# Altium project gtrack_tag_v2.PrjPcb (part 2 of 2)

## Sheet buck_converter.SchDoc
size 297 x 209 mm; DrawnBy: Supun; Engineer: Supun; Organization: C3
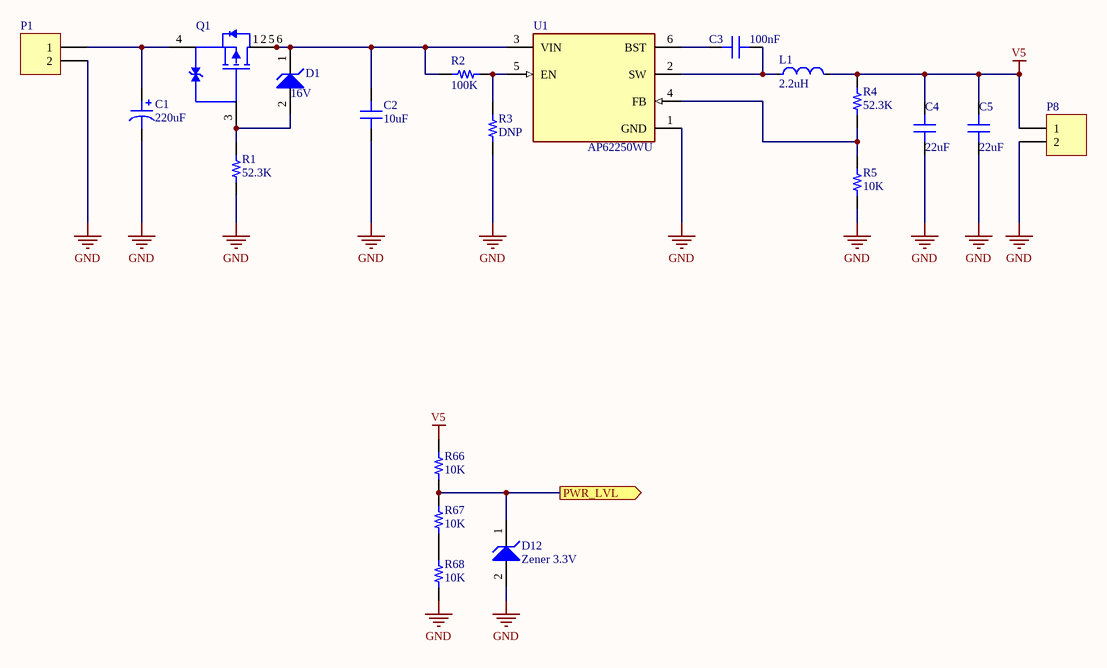
[diagram p10: buck_converter.SchDoc]

### Parts
C1  220uF  [CAP TH ALUM ELEC D10.00mm S5.00mm H12.50mm]
C2  10uF  [CAP 0603_1608]
C3  100nF  [CAP 0603_1608]
C4  22uF  [CAP 0603_1608]
C5  22uF  [CAP 0603_1608]
D1  16V  [Diodes_SOD-123_0]
D12  Zener 3.3V  [Diodes_SOD-123_0]
L1  2.2uH  [Vishay_IHLP-2020CZ-FP_1_905x2_79-3D_3_0_MFG]
P1  *  [TEConn_EP2.5_1x2]  (value not drawn)
P8  DNP  [HDR1X2]  (value not drawn)
Q1  P Mosfet  [Diodes_Inc._TSOT26_MFG]  (value not drawn)
R1  52.3K  [RES 0603_1608]
R2  100K  [RES 0603_1608]
R3  DNP  [RES 0603_1608]
R4  52.3K  [RES 0603_1608]
R5  10K  [RES 0603_1608]
R66  10K  [RES 0603_1608]
R67  10K  [RES 0603_1608]
R68  10K  [RES 0603_1608]
U1  AP62250WU  [Diodes_Inc._TSOT26_MFG]

### Ports
PWR_LVL (out)

### Nets
GND: C1.2 C2.2 C4.2 C5.2 D12.2(A) P1.2 P8.2 R1.2 R3.2 R5.2 R68.2 U1.1(GND)
V5: C4.1 C5.1 L1.2 P8.1 R4.1 R66.1
PWR_LVL: D12.1(K) R66.2 R67.1 ; port PWR_LVL
NetC1_1: C1.1 P1.1 Q1.4(S)
NetC2_1: C2.1 D1.1(K) Q1.1(D) Q1.2(D) Q1.5(D) Q1.6(D) R2.2 U1.3(VIN)
NetC3_1: C3.1 U1.6(BST)
NetC3_2: C3.2 L1.1 U1.2(SW)
NetD1_2: D1.2(A) Q1.3(G) R1.1
NetR2_1: R2.1 R3.1 U1.5(EN)
NetR4_2: R4.2 R5.1 U1.4(FB)
NetR67_2: R67.2 R68.1

### Notes on the sheet
- Title
- Size:
- Date:
- A4
- Number:
- Time:
- Revision:
- Sheet
- of
- File:

### Library data of the parts
C1 = Polarised Capacitor: SMT Polarised Capacitor; MF: KEMET; MP: ESK227M035AH1AA; Value: 220uF; Link: https://www.mouser.com/ProductDetail/KEMET/ESH227M050AH1AA?qs=w9hhVRgtvfmnb2YOvt619g%3D%3D
C2 = Capacitor: SMT Capacitor; MF: Murata; MP: GRM188R61C106MAALD; Value: 10uF; Link: https://www.mouser.com/ProductDetail/Murata-Electronics/GRM188R61C106MAALD?qs=hNud%2FORuBR3LEOKZ4RJp9w%3D%3D
C3 = Capacitor: SMT Capacitor; MF: TDK; MP: CGA3E2X7R1E104K080AA; Value: 100nF; Link: https://www.mouser.com/ProductDetail/TDK/CGA3E2X7R1E104K080AA?qs=NRhsANhppD%2Fm7%2FOmmsm0vg%3D%3D
C4 C5 = Capacitor: SMT Capacitor; MF: Murata; MP: GRM188R61A226ME15D; Value: 22uF; Link: https://www.mouser.com/ProductDetail/Murata-Electronics/GRM188R61A226ME15D?qs=eeBpzGFlv%252B8DV%2FrilzyhAw%3D%3D
D1 = Zener Diode: Zener Voltage Regulator; Manufacturer: On Semiconductor; Packing: Tape and Reel; P Max (W): 0.5; VZ Typ (V): 4.7; MF: Onsemi; MP: MMSZ5246BT1G; ComponentLink1Description: Manufacturer URL; ComponentLink2Description: Datasheet; DatasheetVersion: Rev. 12; ComponentLink3URL: http://www.onsemi.com/pub_link/Collateral/425-04.PDF; ComponentLink3Description: Package Specification; ComponentLink1URL: http://www.onsemi.com/; ComponentLink2URL: http://www.onsemi.com/pub_link/Collateral/MMSZ5221BT1-D.PDF; PackageVersion: Rev. G, 10/2009; PackageReference: SOD-123-2-425-04; PackageDescription: 2-Pin SOD, Body 1.6 x 2.69 mm; Mounting Technology: Surface Mount; RoHS: Pb-Free; Value: 16V; Link: https://www.mouser.com/ProductDetail/onsemi/MMSZ5246BT1G?qs=P4IOph%252Bbot93aqBP107C%2FQ%3D%3D
D12 = Zener Diode: Zener Voltage Regulator; Manufacturer: On Semiconductor; Packing: Tape and Reel; P Max (W): 0.5; VZ Typ (V): 4.7; MF: Onsemi; MP: MMSZ5226BT1G; ComponentLink1Description: Manufacturer URL; ComponentLink2Description: Datasheet; DatasheetVersion: Rev. 12; ComponentLink3URL: http://www.onsemi.com/pub_link/Collateral/425-04.PDF; ComponentLink3Description: Package Specification; ComponentLink1URL: http://www.onsemi.com/; ComponentLink2URL: http://www.onsemi.com/pub_link/Collateral/MMSZ5221BT1-D.PDF; PackageVersion: Rev. G, 10/2009; PackageReference: SOD-123-2-425-04; PackageDescription: 2-Pin SOD, Body 1.6 x 2.69 mm; Mounting Technology: Surface Mount; RoHS: Pb-Free; Value: Zener 3.3V; Link: https://www.mouser.com/ProductDetail/onsemi/MMSZ5226BT1G?qs=P4IOph%252Bbot%2Ft8yNxdh48XQ%3D%3D
L1 = Inductor_sm: Fixed Inductors 2.2uH 20% High Temp AEC-Q200; MF: Vishay; MP: IHLP2020CZER2R2M11; Value: 2.2uH; Link: https://www.mouser.com/ProductDetail/Vishay-Dale/IHLP2020CZER2R2M11?qs=6luCnr706CzLTrsnHEyf2A%3D%3D
P1 = Header 2H: Header, 2-Pin, Right Angle; MF: TE Connectivity; MP: 1744426-2; LatestRevisionDate: 17-Jul-2002; LatestRevisionNote: Re-released for DXP Platform.; Publisher: Altium Limited; Value: *; Link: https://www.mouser.com/ProductDetail/TE-Connectivity-AMP/1744426-2?qs=IGPQaF7TU6sqa55bZxfMjA%3D%3D
P8 = Header 2: Header, 2-Pin; LatestRevisionDate: 17-Jul-2002; LatestRevisionNote: Re-released for DXP Platform.; Publisher: Altium Limited; Value: DNP; Link: https://
Q1 = Mosfet-P-6_ESD: P-Channel Enhancement Mode MOS Transistor, 3-Pin SOT23; MF: Vishay; MP: SI3421DV-T1-GE3; Value: P Mosfet; Link: https://www.mouser.com/ProductDetail/Vishay-Semiconductors/SI3421DV-T1-GE3?qs=dpt6vIvaxwjvmZPXyyVpRg%3D%3D
R1 R4 = Resistor: SMT Resistor; MF: YAGEO; MP: AC0603FR-0752K3L; Value: 52.3K; Link: https://www.mouser.com/ProductDetail/YAGEO/AC0603FR-0752K3L?qs=ygRr%2Ftkhtes52vQmIU4puQ%3D%3D
R2 R3 = Resistor: SMT Resistor; MF: YAGEO; MP: AC0603FR-07100KL; Link: https://www.mouser.com/ProductDetail/YAGEO/AC0603FR-07100KL?qs=UoPT7wUmgYKBKZ83mTH%252BSA%3D%3D
  R2: Value: 100K
  R3: Value: DNP
R5 R66-R68 = Resistor: SMT Resistor; MF: YAGEO; MP: AC0603FR-0710KL; Value: 10K; Link: https://www.mouser.com/ProductDetail/YAGEO/AC0603FR-0710KL?qs=UoPT7wUmgYKz3zh0UDMA4Q%3D%3D
U1 = AP62250WU: Switching Voltage Regulators DCDC Conv HV Buck TSOT26; MF: Diodes Incorporated; MP: AP62250WU-7; Link: https://www.mouser.com/ProductDetail/Diodes-Incorporated/AP62250WU-7?qs=7MVldsJ5Uax1PUc8sdeimQ%3D%3D

## Sheet motion_sensor.SchDoc
size 297 x 209 mm; DrawnBy: Supun; Engineer: Supun; Organization: C3
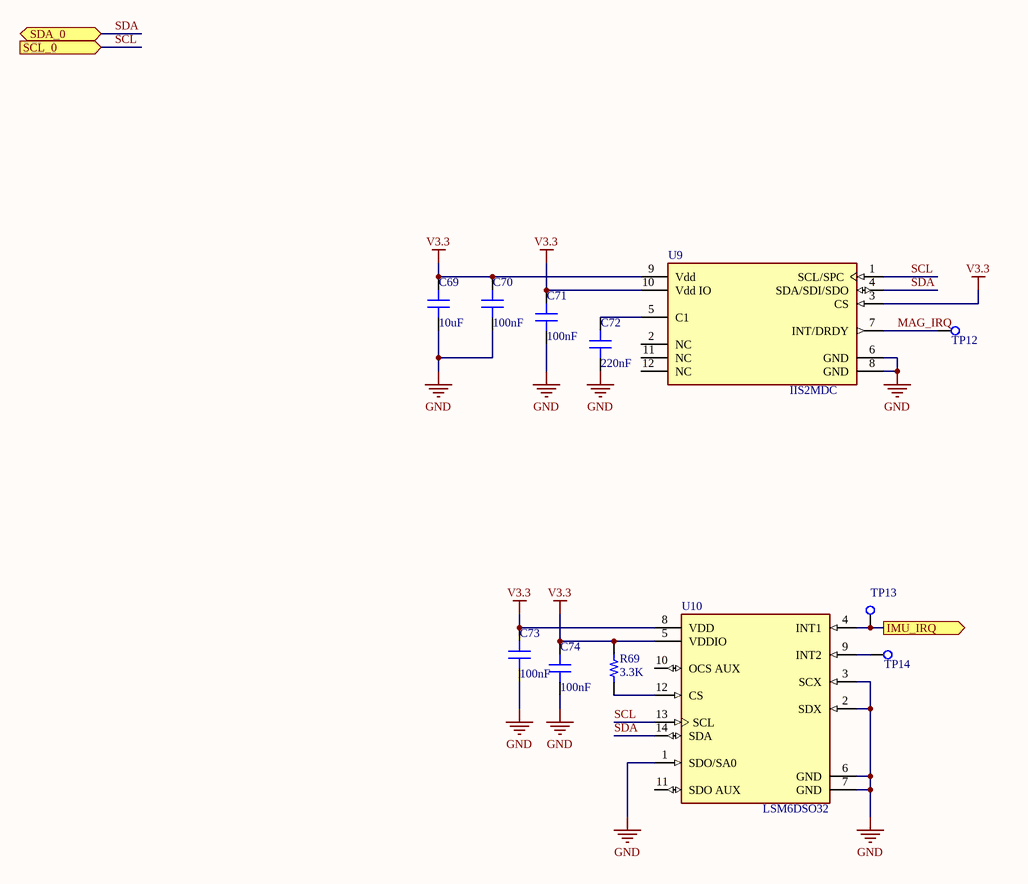
[diagram p11: motion_sensor.SchDoc]

### Parts
C69  10uF  [CAP 0603_1608]
C70  100nF  [CAP 0603_1608]
C71  100nF  [CAP 0603_1608]
C72  220nF  [CAP 0603_1608]
C73  100nF  [CAP 0603_1608]
C74  100nF  [CAP 0603_1608]
R69  3.3K  [RES 0603_1608]
TP12  Test Point  [TPSMD_S1]  (value not drawn)
TP13  Test Point  [TPSMD_S1]  (value not drawn)
TP14  Test Point  [TPSMD_S1]  (value not drawn)
U9  IIS2MDC  [STMicroelectronics_LGA-12-DM00170568_MFG]
U10  LSM6DSO32  [STMicroelectronics_LGA-14L-DM00249496_MFG]

### Ports
IMU_IRQ (out), SCL_0 (in), SDA_0 (bidir)

### Nets
GND: C69.2 C70.2 C71.2 C72.2 C73.2 C74.2 U9.6(GND) U9.8(GND) U10.1(SDO/SA0) U10.2(SDX) U10.3(SCX) U10.6(GND) U10.7(GND)
V3.3: C69.1 C70.1 C71.1 C73.1 C74.1 R69.2 U9.3(CS) U9.9(Vdd) U9.10(Vdd_IO) U10.5(VDDIO) U10.8(VDD)
IMU_IRQ: TP13.1(TP) U10.4(INT1) ; port IMU_IRQ
MAG_IRQ: TP12.1(TP) U9.7(INT/DRDY)
SCL: U9.1(SCL/SPC) U10.13(SCL) ; port SCL_0
SDA: U9.4(SDA/SDI/SDO) U10.14(SDA) ; port SDA_0
NetC72_1: C72.1 U9.5(C1)
NetR69_1: R69.1 U10.12(CS)
NetTP14_1: TP14.1(TP) U10.9(INT2)

Not connected (* = marked no-connect by the designer): U9 2(NC) 11(NC) 12(NC); U10 10(OCS_AUX) 11(SDO_AUX)

### Notes on the sheet
- Title
- Size:
- Date:
- A4
- Number:
- Time:
- Revision:
- Sheet
- of
- File:

### Library data of the parts
C69 = Capacitor: as C2 on sheet buck_converter; Value: 10uF; Link: https://www.mouser.com/ProductDetail/Murata-Electronics/GRM188R61C106MAALD?qs=hNud%2FORuBR3LEOKZ4RJp9w%3D%3D
C70 C71 C73 C74 = Capacitor: as C3 on sheet buck_converter; Value: 100nF; Link: https://www.mouser.com/ProductDetail/TDK/CGA3E2X7R1E104K080AA?qs=NRhsANhppD%2Fm7%2FOmmsm0vg%3D%3D
C72 = Capacitor: SMT Capacitor; MF: Samsung; MP: CL10B224KO8NNNC; Value: 220nF; Link: https://www.mouser.com/ProductDetail/Samsung-Electro-Mechanics/CL10B224KO8NNNC?qs=349EhDEZ59ovd%252B6gRVIaTg%3D%3D
R69 = Resistor: SMT Resistor; MF: YAGEO; MP: AC0603FR-073K3L; Value: 3.3K; Link: https://www.mouser.com/ProductDetail/YAGEO/AC0603FR-073K3L?qs=yhV1fb9g%2FKZasQ4U0IUUCA%3D%3D
U9 = IIS2MDCTR: Board Mount Hall Effect / Magnetic Sensors High accuracy, ultra-low-power ,3-axis digital output magnetometer; MF: STMicroelectronics; MP: IIS2MDCTR; Link: https://www.mouser.com/ProductDetail/STMicroelectronics/IIS2MDCTR?qs=1mbolxNpo8ems1K%2FRdQzXg%3D%3D
U10 = LSM6DSOTR: Inertial Measurement Unit, 6-axis, I2C, SPI, 1.7V-3.6V; MF: STMicroelectronics; MP: LSM6DSO32TR; Link: https://www.mouser.com/ProductDetail/STMicroelectronics/LSM6DSO32TR?qs=rI7uf1IzohQPdukPhHG9Gw%3D%3D
TP12-TP14 = Test Point: Link: https://

## Nets that join several sheets
GND: battery_charger (12 pins), buck_boost_converter (9 pins), microcontroller (25 pins), rfid_reader (29 pins), ultra_wideband (44 pins), button_panel (5 pins), barcode_scanner (C14.1 C15.2 P3.3 P7.2), buzzer (Q5.2), epd_driver (20 pins), buck_converter (12 pins), motion_sensor (13 pins)
V3.3: buck_boost_converter (6 pins), microcontroller (24 pins), ultra_wideband (12 pins), button_panel (8 pins), epd_driver (Q8.4 R62.1), motion_sensor (11 pins)
V3.3P: buck_boost_converter (6 pins), rfid_reader (6 pins), button_panel (C20.2 P4.1), barcode_scanner (C14.2 C15.1 P3.2), buzzer (D8.1 LS1.1 R59.2)
V5: battery_charger (8 pins), buck_converter (6 pins)
VSUP: battery_charger (D3.1 Q7.4 R9.1), buck_boost_converter (5 pins)
BAT_LVL: battery_charger (D4.1 R11.2 R12.1), microcontroller (U4.38)
BTN_1: microcontroller (U4.8), button_panel (C16.1 R14.1 S1.4)
BTN_2: microcontroller (U4.9), button_panel (C17.1 R15.1 S2.3)
BTN_3: microcontroller (U4.11), button_panel (C18.1 R16.1 S3.4)
BTN_4: microcontroller (U4.12), button_panel (C19.1 R17.1 S4.3)
BTN_EXT: microcontroller (U4.40), button_panel (C20.1 P4.3 R18.1)
BUZZER: microcontroller (U4.29), buzzer (R60.1)
DISP_CS: microcontroller (U4.34), epd_driver (P6.12)
DISP_DC: microcontroller (U4.35), epd_driver (P6.11)
DISP_IRQ: microcontroller (U4.36), epd_driver (P6.9)
IMU_IRQ: microcontroller (U4.16), motion_sensor (TP13.1 U10.4)
MISO_0: microcontroller (U4.2), ultra_wideband (U7.40)
MISO_1: microcontroller (U4.15), rfid_reader (U6.16)
MOSI_0: microcontroller (U4.5), ultra_wideband (U7.39)
MOSI_1: microcontroller (U4.14), rfid_reader (U6.17), epd_driver (P6.14)
PWR_CON: buck_boost_converter (R40.1), microcontroller (U4.30)
PWR_LVL: microcontroller (U4.39), buck_converter (D12.1 R66.2 R67.1)
RFID_CS: microcontroller (U4.27), rfid_reader (U6.15)
RFID_IRQ: microcontroller (U4.28), rfid_reader (R43.1 U6.14)
RST: microcontroller (U4.37), epd_driver (P6.10 R64.1)
RX_1: microcontroller (U4.32), barcode_scanner (P3.5)
SCK_0: microcontroller (U4.4), ultra_wideband (U7.41)
SCK_1: microcontroller (U4.13), rfid_reader (U6.18), epd_driver (P6.13)
SCL: microcontroller (R28.1 U4.18), motion_sensor (U9.1 U10.13)
SDA: microcontroller (R29.1 U4.17), motion_sensor (U9.4 U10.14)
TX_1: microcontroller (U4.31), barcode_scanner (P3.4)
UWB_CS: microcontroller (U4.3), ultra_wideband (U7.24)
UWB_IRQ: microcontroller (U4.7), ultra_wideband (R53.2 U7.45)
UWB_RST: microcontroller (U4.6), ultra_wideband (U7.27)